# EAGLE design entropy_king_dk (EAGLE 6.5.0)

## Sheet 1 of 2
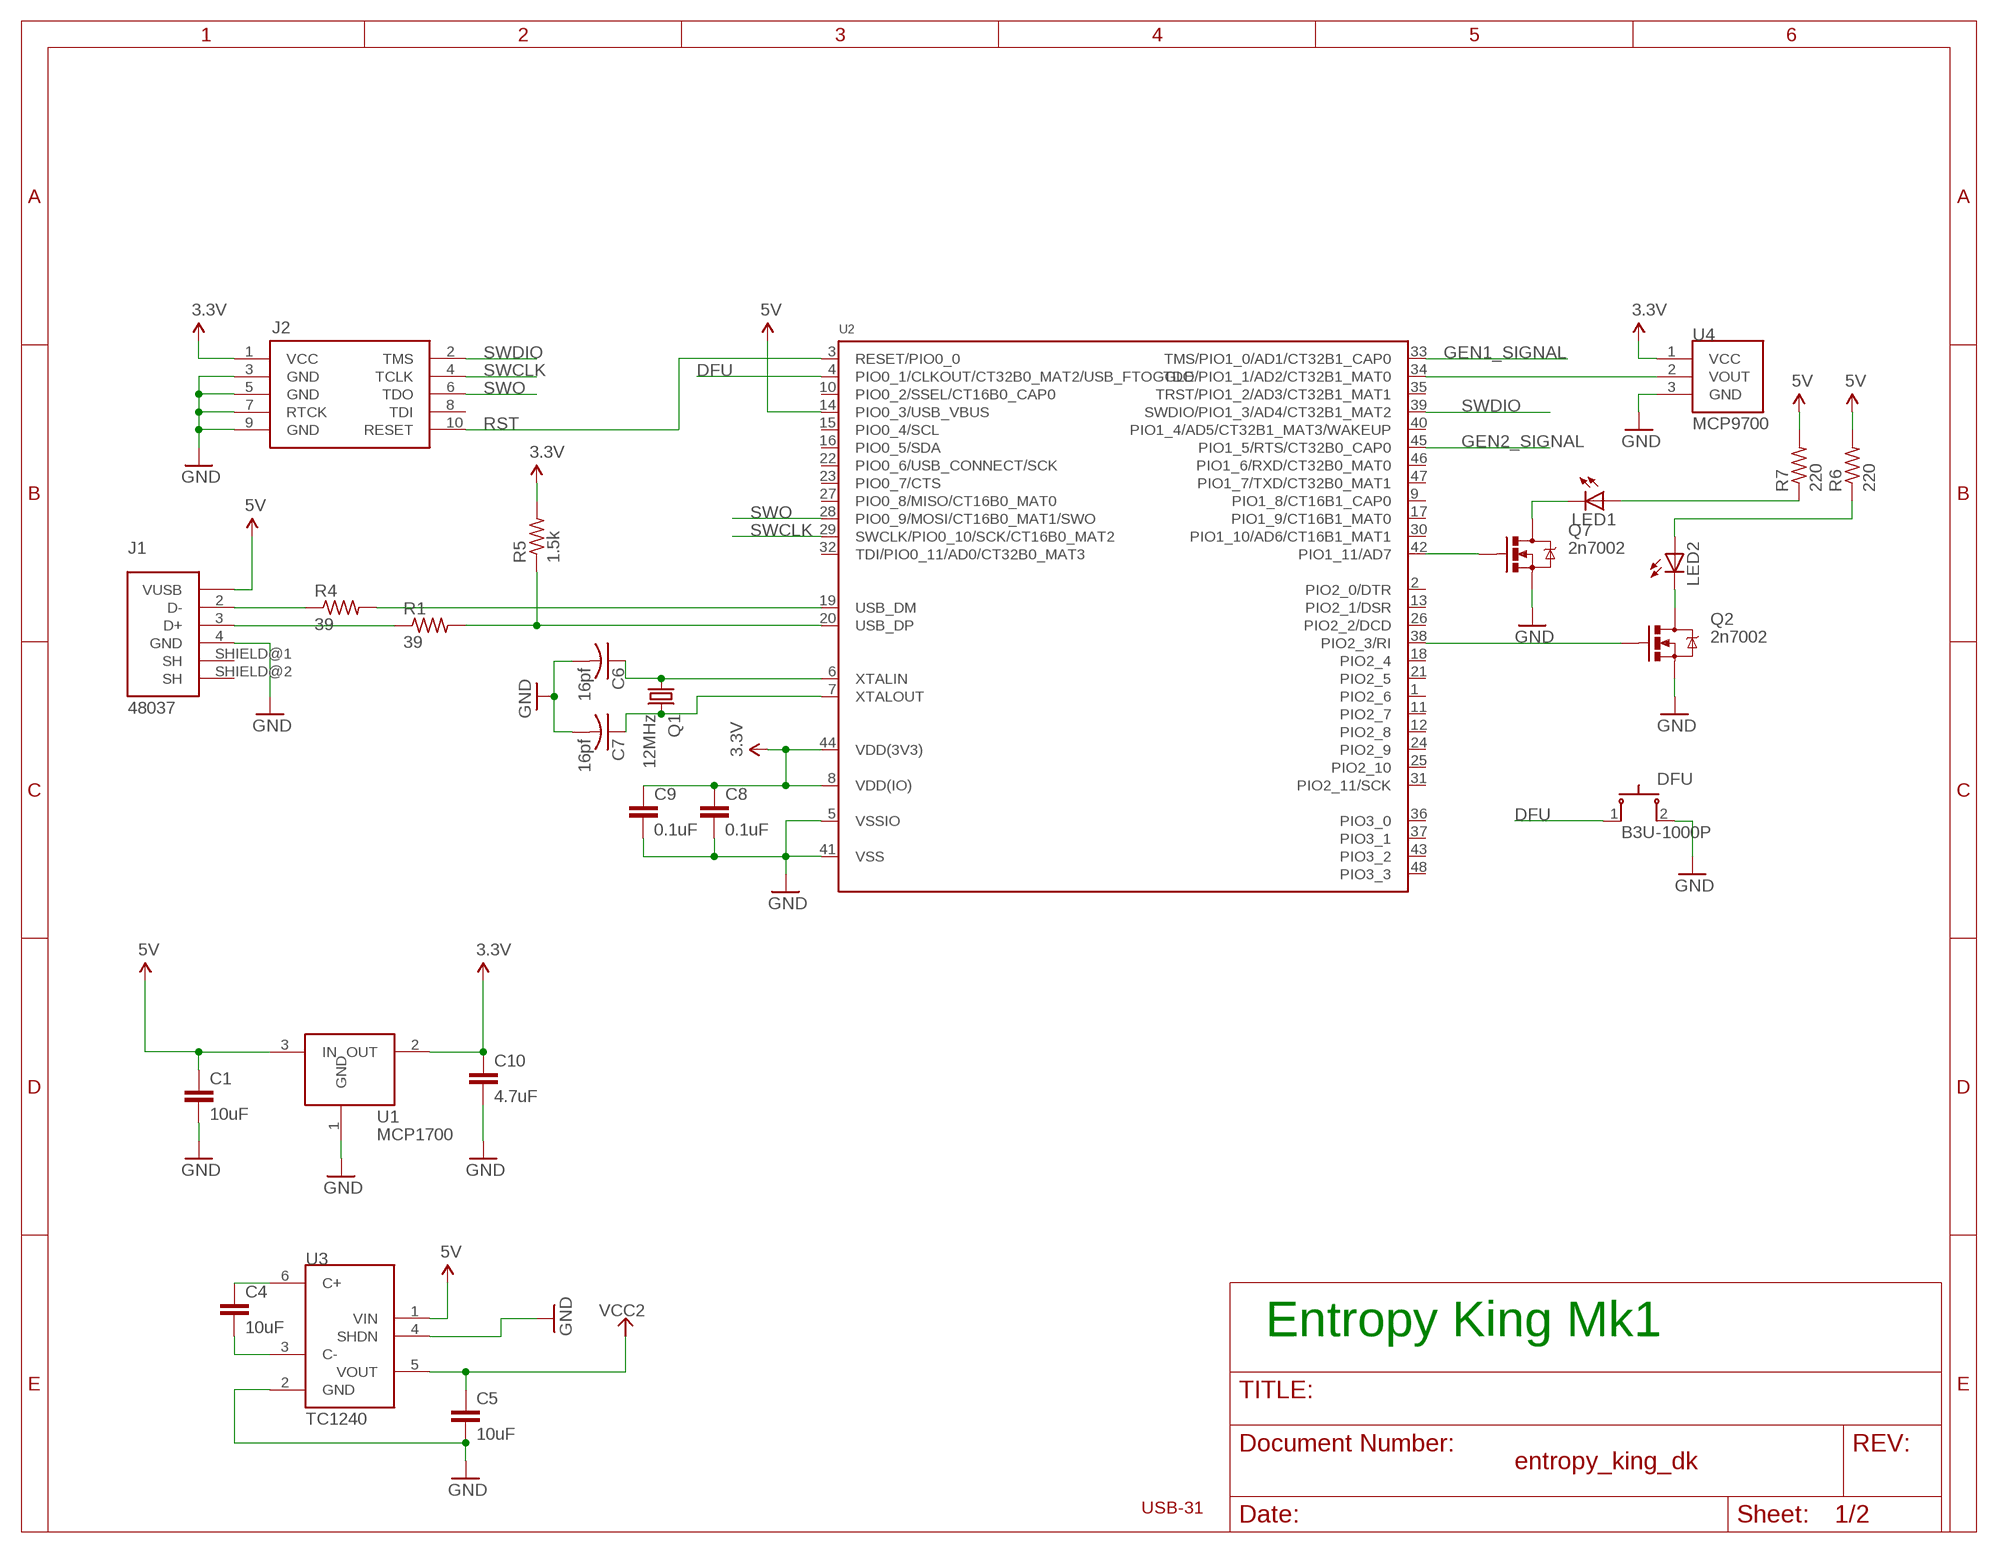
[diagram p0: schematic, sheet 1]

### Parts
C1  10uF  C-EUC0805  [C0805]
C4  10uF  C-EUC0805  [C0805]
C5  10uF  C-EUC0805  [C0805]
C6  16pf  C-USC0603  [C0603]
C7  16pf  C-USC0603  [C0603]
C8  0.1uF  C-EUC0603  [C0603]
C9  0.1uF  C-EUC0603  [C0603]
C10  4.7uF  C-EUC0603  [C0603]
CASE1  USB-31  [USB-31]
DFU  B3U-1000P  [B3U-1000P]
J1  48037  [48037]
J2  ARM_MINI_10PIN_JTAG  [2X05_SMD]
LED1  LED1206  [LED-1206]
LED2  LED1206  [LED-1206]
Q1  12MHz  CRYSTAL25X3.2  [CRYSTAL-SMD-5X3.2]
Q2  2n7002  MOSFET-NCHANNELSMD  [SOT23-3]
Q7  2n7002  MOSFET-NCHANNELSMD  [SOT23-3]
R1  39  R-US_R0603  [R0603]
R4  39  R-US_R0603  [R0603]
R5  1.5k  R-US_R0603  [R0603]
R6  220  R-US_R0603  [R0603]
R7  220  R-US_R0603  [R0603]
U1  MCP1700  [SOT23]
U2  LPC1343_QFP  [LQFP48]
U3  TC1240  [SOT23-6L]
U4  MCP9700  [SOT23]

### Nets
3.3V: C8.1 C9.1 C10.1 J2.1(VCC) R5.2 U1.2(OUT) U2.8(VDD(IO)) U2.44(VDD(3V3)) U4.1(VCC) ; also sheet 2
5V: C1.1 J1.1(VUSB) R6.2 R7.2 U1.3(IN) U2.14(PIO0_3/USB_VBUS) U3.1(VIN)
DFU: DFU.1 U2.4(PIO0_1/CLKOUT/CT32B0_MAT2/USB_FTOGGLE)
GEN1_SIGNAL: U2.33(TMS/PIO1_0/AD1/CT32B1_CAP0) ; also sheet 2
GEN2_SIGNAL: U2.45(PIO1_5/RTS/CT32B0_CAP0) ; also sheet 2
GND: C1.2 C5.2 C6.2 C7.2 C8.2 C9.2 C10.2 DFU.2 J1.4(GND) J2.3(GND) J2.5(GND) J2.7(RTCK) J2.9(GND) Q2.2(S) Q7.2(S) U1.1(GND) U2.5(VSSIO) U2.41(VSS) U3.2(GND) U3.4(SHDN) U4.3(GND) ; also sheet 2
N$2: J1.2(D-) R4.1
N$4: C4.1 U3.6(C+)
N$5: C4.2 U3.3(C-)
N$6: J1.3(D+) R1.1
N$11: Q7.1(G) U2.42(PIO1_11/AD7)
N$12: R4.2 U2.19(USB_DM)
N$14: R1.2 R5.1 U2.20(USB_DP)
N$15: Q2.1(G) U2.38(PIO2_3/RI)
N$16: LED2.C Q2.3(D)
N$17: LED1.C Q7.3(D)
N$18: LED2.A R6.1
N$19: LED1.A R7.1
N$20: U2.34(TDO/PIO1_1/AD2/CT32B1_MAT0) U4.2(VOUT)
RST: J2.10(RESET) U2.3(RESET/PIO0_0)
SWCLK: J2.4(TCLK) U2.29(SWCLK/PIO0_10/SCK/CT16B0_MAT2)
SWDIO: J2.2(TMS) U2.39(SWDIO/PIO1_3/AD4/CT32B1_MAT2)
SWO: J2.6(TDO) U2.28(PIO0_9/MOSI/CT16B0_MAT1/SWO)
VCC2: C5.1 U3.5(VOUT) ; also sheet 2
XIN: C6.1 Q1.1 U2.6(XTALIN)
XOUT: C7.1 Q1.3 U2.7(XTALOUT)
Unconnected: J1.SHIELD@1(SH) J1.SHIELD@2(SH) J2.8(TDI) U2.1(PIO2_6) U2.2(PIO2_0/DTR) U2.9(PIO1_8/CT16B1_CAP0) U2.10(PIO0_2/SSEL/CT16B0_CAP0) U2.11(PIO2_7) U2.12(PIO2_8) U2.13(PIO2_1/DSR) U2.15(PIO0_4/SCL) U2.16(PIO0_5/SDA) U2.17(PIO1_9/CT16B1_MAT0) U2.18(PIO2_4) U2.21(PIO2_5) U2.22(PIO0_6/USB_CONNECT/SCK) U2.23(PIO0_7/CTS) U2.24(PIO2_9) U2.25(PIO2_10) U2.26(PIO2_2/DCD) U2.27(PIO0_8/MISO/CT16B0_MAT0) U2.30(PIO1_10/AD6/CT16B1_MAT1) U2.31(PIO2_11/SCK) U2.32(TDI/PIO0_11/AD0/CT32B0_MAT3) U2.35(TRST/PIO1_2/AD3/CT32B1_MAT1) U2.36(PIO3_0) U2.37(PIO3_1) U2.40(PIO1_4/AD5/CT32B1_MAT3/WAKEUP) U2.43(PIO3_2) U2.46(PIO1_6/RXD/CT32B0_MAT0) U2.47(PIO1_7/TXD/CT32B0_MAT1) U2.48(PIO3_3)

### Notes on the sheet
- Entropy King Mk1

## Sheet 2 of 2
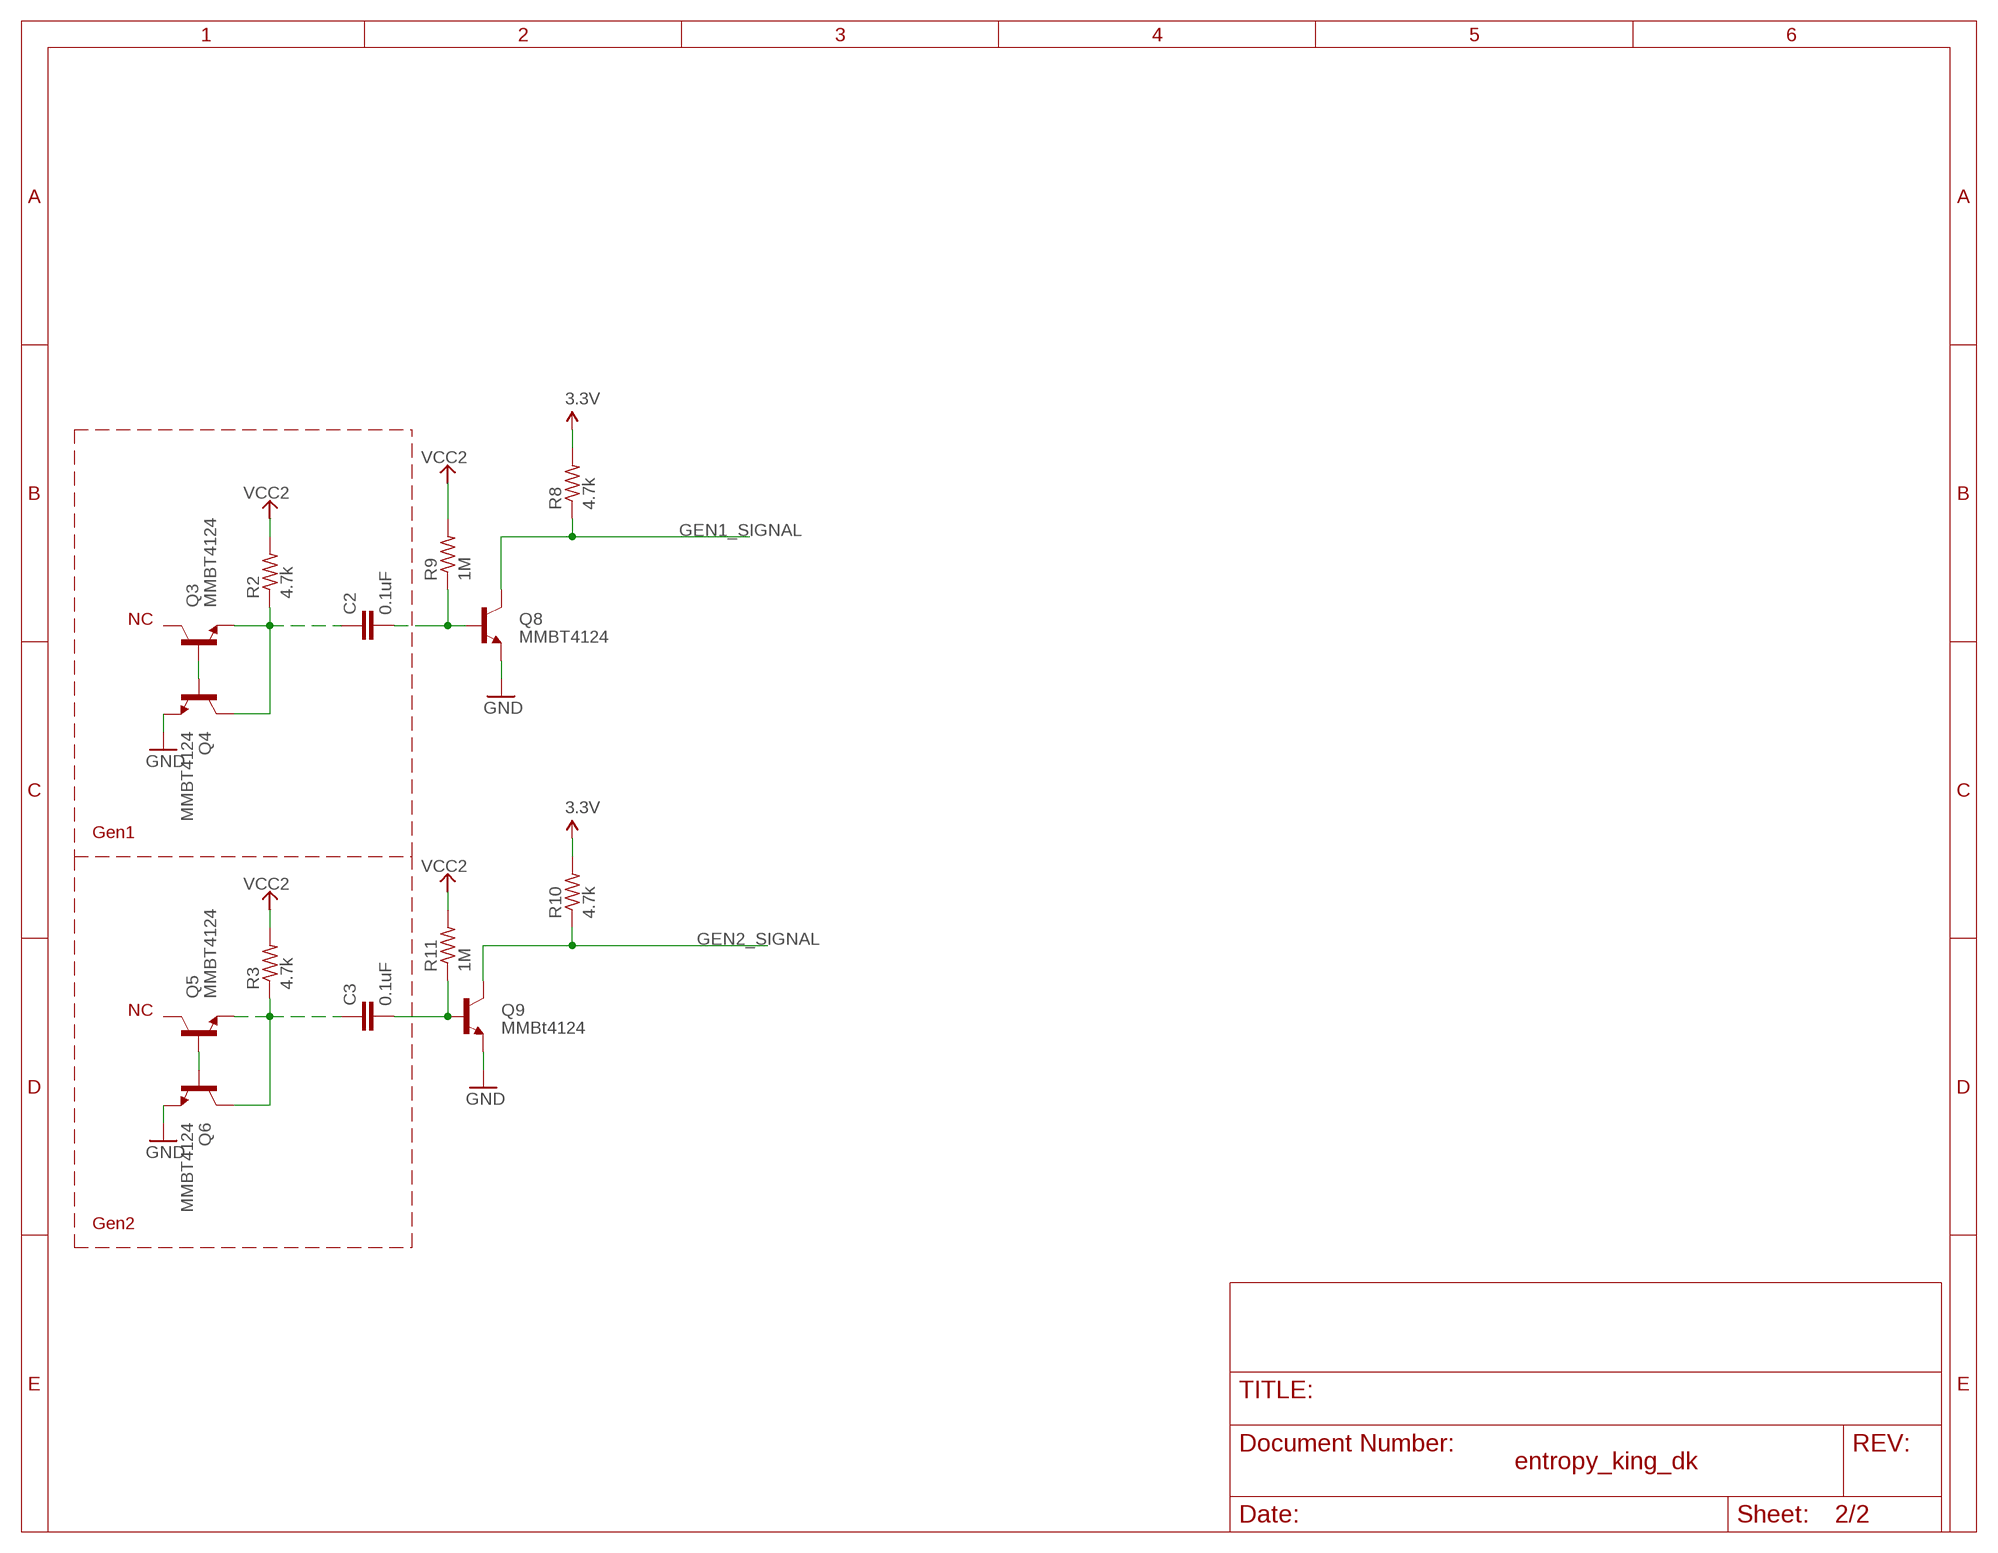
[diagram p1: schematic, sheet 2]

### Parts
C2  0.1uF  C-EUC0603  [C0603]
C3  0.1uF  C-EUC0603  [C0603]
Q3  MMBT4124  TRANSISTOR_NPNSOT23-3  [SOT23-3]
Q4  MMBT4124  TRANSISTOR_NPNSOT23-3  [SOT23-3]
Q5  MMBT4124  TRANSISTOR_NPNSOT23-3  [SOT23-3]
Q6  MMBT4124  TRANSISTOR_NPNSOT23-3  [SOT23-3]
Q8  MMBT4124  TRANSISTOR_NPNSOT23-3  [SOT23-3]
Q9  MMBt4124  TRANSISTOR_NPNSOT23-3  [SOT23-3]
R2  4.7k  R-US_R0603  [R0603]
R3  4.7k  R-US_R0603  [R0603]
R8  4.7k  R-US_R0603  [R0603]
R9  1M  R-US_R0603  [R0603]
R10  4.7k  R-US_R0603  [R0603]
R11  1M  R-US_R0603  [R0603]

### Nets
3.3V: R8.2 R10.2 ; also sheet 1
GEN1_SIGNAL: Q8.3(C) R8.1 ; also sheet 1
GEN2_SIGNAL: Q9.3(C) R10.1 ; also sheet 1
GND: Q4.2(E) Q6.2(E) Q8.2(E) Q9.2(E) ; also sheet 1
N$1: C2.2 Q8.1(B) R9.1
N$3: C3.2 Q9.1(B) R11.1
N$7: C2.1 Q3.2(E) Q4.3(C) R2.1
N$8: Q3.1(B) Q4.1(B)
N$9: Q5.1(B) Q6.1(B)
N$10: C3.1 Q5.2(E) Q6.3(C) R3.1
VCC2: R2.2 R3.2 R9.2 R11.2 ; also sheet 1
Unconnected: Q3.3(C) Q5.3(C)

### Notes on the sheet
- NC
- Gen1
- NC
- Gen2

## Library data of the parts
C1-C5 C8-C10 = rcl:C-EU: CAPACITOR, European symbol
C6 C7 = rcl:C-US: CAPACITOR, American symbol
CASE1 = polycase:USB-31
DFU = switch:B3U-1000P: Ultra Small Tactile Switch
J1 = con-molex:48037: Molex 48037-1000 Surface mount connector with milling layer for tabs.
J2 = con-headers:ARM_MINI_10PIN_JTAG: New style 0.05inch header mini ARM JTAG
LED1 LED2 = SparkFun:LED: LEDs Standard schematic elements and footprints for 5mm, 3mm, 1206, and 0603 sized LEDs. 5mm - Spark Fun Electronics SKU : COM-00529 (and others)
Q1 = xtal:CRYSTAL2: Crystals
Q2 Q7 = SparkFun:MOSFET-NCHANNEL
Q3-Q6 Q8 Q9 = StackFoundry:TRANSISTOR_NPN: Transistor NPN BJT configuration in SOT23 package. MMBT2222 is the common NPN we use. Double check BCE configuration again layout.
R1-R11 = rcl:R-US_: RESISTOR, American symbol
U1 = microchip:MCP1700
U2 = microbuilder:LPC1343_QFP: LPC1343 72 MHz 32-bit ARM Cortex-M3 microcontroller. 32 kB Flash, 8 kB SRAM, USB Device Mouser: 771-LPC1343FBD48151 Digikey: 568-4945-ND
U3 = microchip:TC1240: TC1240/TC1240A Microchip capacitor switcher voltage doubler. Use TC1240A for 5V input systems. 4.7-10-47uF Ceramic capacitors recommended
U4 = microchip:MCP9700: MCP9700 series temperature sensors -40-125C

## Board
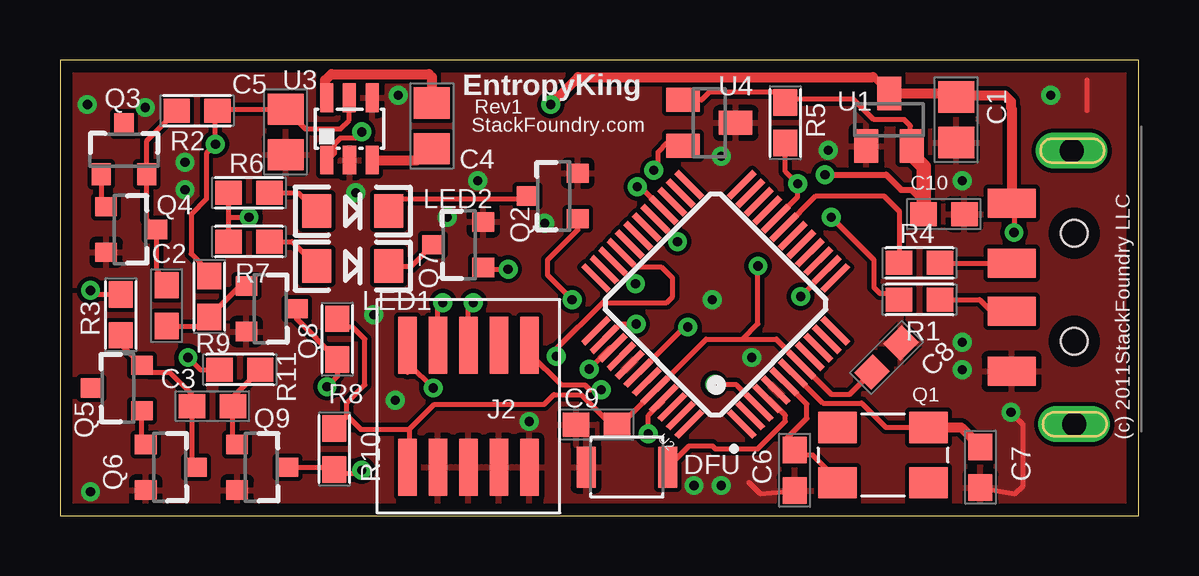
[diagram p2: board, top side]
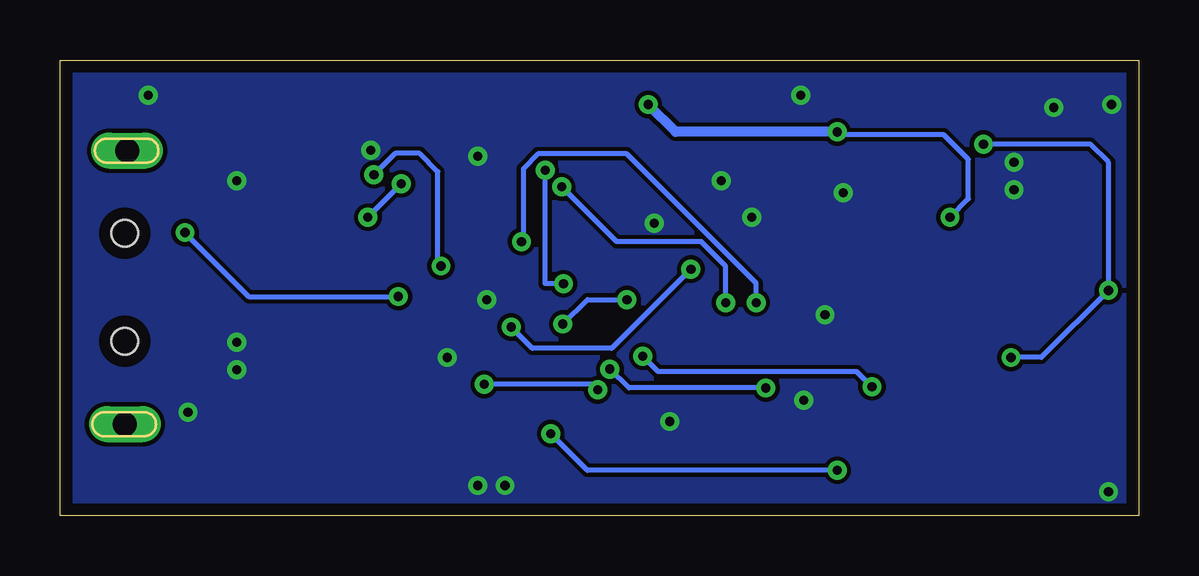
[diagram p3: board, bottom side, seen from below]

Size 44.96 x 19 mm. Coordinates in mm from the lower left corner, seen from the top.
Outline: 0,0 44.96,0 44.96,19 0,19 0,0
Copper layers (1*16): Top 0.035mm / dielectric 1.5mm / Bottom 0.035mm
Design rules "default *": minimum track width 8mil, minimum drill 15mil, track to track 7mil, track to pad 7mil, pad to pad 7mil, via to via 7mil, smd to smd 5mil, copper to edge 20mil, drill to drill 8mil, minimum pad ring 8mil, minimum via ring 8mil, stop-mask expansion 4mil, vias tented up to drill 15mil, thermal gap 10mil

### Footprints (pad centres in the part's own frame; a part is rotated, then mirrored left to right if it is on the bottom)
C0805 = smd 1.3 x 1.5: 1 -0.95,0; 2 0.95,0
C0603 = smd 1.1 x 1: 1 -0.85,0; 2 0.85,0
B3U-1000P = smd 0.8 x 1.7: 1 -1.7,0; 2 1.7,0
48037 = smd 1.2 x 2: 1 3.5,2; 2 1,2; 3 -1,2; 4 -3.5,2 | drill 1 long: SHIELD@1 5.7,-0.5; SHIELD@2 -5.7,-0.6 | hole 1.1: -2.25,-0.6; 2.25,-0.6
2X05_SMD = smd 0.762 x 2.388: 1 -5.08,-3.81; 2 -5.08,1.27; 3 -3.81,-3.81; 4 -3.81,1.27; 5 -2.54,-3.81; 6 -2.54,1.27; 7 -1.27,-3.81; 8 -1.27,1.27; 9 0,-3.81; 10 0,1.27
LED-1206 = smd 1.2 x 1.4: A -1.5,0; C 1.5,0
CRYSTAL-SMD-5X3.2 = smd 1.6 x 1.3: 1 -1.9,-1.15; 2 1.9,-1.15; 3 1.9,1.15; 4 -1.9,1.15
SOT23-3 = smd 0.8 x 0.9: 1 -0.95,-1; 2 0.95,-1; 3 0,1.1
R0603 = smd 1.1 x 1: 1 -0.85,0; 2 0.85,0
SOT23 = smd 1 x 1.4: 1 -0.95,-1.1; 2 0.95,-1.1; 3 0,1.1
LQFP48 = smd 1.5 x 0.25: 1 -4.3,2.75; 2 -4.3,2.25; 3 -4.3,1.75; 4 -4.3,1.25; 5 -4.3,0.75; 6 -4.3,0.25; 7 -4.3,-0.25; 8 -4.3,-0.75; 9 -4.3,-1.25; 10 -4.3,-1.75; 11 -4.3,-2.25; 12 -4.3,-2.75; 25 4.3,-2.75; 26 4.3,-2.25; 27 4.3,-1.75; 28 4.3,-1.25; 29 4.3,-0.75; 30 4.3,-0.25; 31 4.3,0.25; 32 4.3,0.75; 33 4.3,1.25; 34 4.3,1.75; 35 4.3,2.25; 36 4.3,2.75 | smd 0.25 x 1.5: 13 -2.75,-4.3; 14 -2.25,-4.3; 15 -1.75,-4.3; 16 -1.25,-4.3; 17 -0.75,-4.3; 18 -0.25,-4.3; 19 0.25,-4.3; 20 0.75,-4.3; 21 1.25,-4.3; 22 1.75,-4.3; 23 2.25,-4.3; 24 2.75,-4.3; 37 2.75,4.3; 38 2.25,4.3; 39 1.75,4.3; 40 1.25,4.3; 41 0.75,4.3; 42 0.25,4.3; 43 -0.25,4.3; 44 -0.75,4.3; 45 -1.25,4.3; 46 -1.75,4.3; 47 -2.25,4.3; 48 -2.75,4.3
SOT23-6L = smd 0.55 x 1.2: 1 -0.95,-1.3; 2 0,-1.3; 3 0.95,-1.3; 4 0.95,1.3; 5 -0.015,1.3; 6 -0.95,1.3

### Placement (x,y rotation side)
C1  37.34,16.51 270 top
C2  4.45,8.76 270 top
C3  6.35,4.57 0 top
C4  15.49,16.26 270 top
C5  9.4,16 270 top
C6  30.61,1.91 270 top
C7  38.35,2.03 270 top
C8  34.44,6.6 45 top
C9  22.35,3.81 180 top
C10  36.83,12.57 0 top
CASE1  44.96,19.05 180 top
DFU  23.62,2.03 180 top
J1  41.66,9.53 90 top
J2  19.56,5.84 0 top
LED1  12.19,10.41 0 top
LED2  12.19,12.7 0 top
Q1  34.29,2.54 0 top
Q2  20.57,13.34 90 top
Q3  2.67,15.24 0 top
Q4  2.92,11.94 270 top
Q5  2.41,5.33 90 top
Q6  4.57,2.03 270 top
Q7  16.64,11.3 90 top
Q8  8.76,8.64 270 top
Q9  8.38,2.03 270 top
R1  35.81,9.02 180 top
R2  5.71,16.89 0 top
R3  2.54,8.38 90 top
R4  35.81,10.54 180 top
R5  30.23,16.38 90 top
R6  7.87,13.46 180 top
R7  7.87,11.43 180 top
R8  11.56,7.37 90 top
R9  6.22,9.14 90 top
R10  11.43,2.79 90 top
R11  7.49,6.1 180 top
U1  34.54,16.51 0 top
U2  27.31,8.82 135 top
U3  12.06,16.13 0 top
U4  27.05,16.38 270 top

### Tracks (layer width: path | path; a pad name or v marks a point on that pad's centre or on a via)
3.3V  (via drill 0.38)
  Top 0.203: 30.91,6.3 U2.8 | 30.91,6.3 32.13,5.08 32.91,5.08 C8.1 | 30.91,6.3 29.84,7.37 28.45,7.37 | 28.45,7.37 26.93,7.37 U2.44 23.37,3.81 C9.1 23.11,3.86 22.91,3.86 21.72,5.05 20.57,5.05 20.17,4.65 15.6,4.65 14.55,3.61 | 35.49,15.05 U1.2 35.43,15.47 35.43,16.26 35.18,16.51 33.91,16.51 33.06,17.36 30.35,17.36 R5.2 29.81,17.65 27.05,17.65 26.73,17.33 U4.1 | v29.08,10.41 29.08,8 28.45,7.37 | J2.1 14.55,2.11 14.55,3.61 | 14.55,3.61 12.52,3.61 11.94,4.19 | 11.94,4.19 11.94,4.7 12.7,5.46 12.7,7.37 12.19,7.87 11.9,7.87 R8.2 | 11.94,4.19 11.94,4.15 R10.2
  Top 0.254: v31.88,14.22 34.42,14.22 35.05,13.59 35.47,13.59 35.98,13.08
  Top 0.61: 35.49,15.05 35.98,14.56 35.98,13.08 C10.1
  Bottom 0.203: v31.88,14.22 30.99,15.11 29.97,15.11 29.21,14.35 29.21,10.54 v29.08,10.41
5V  (via drill 0.38)
  Top 0.203: U2.14 31.95,10.23 v30.86,9.14 | v39.75,11.81 39.75,12.93 J1.1 | R7.2 7.02,12.45 | 7.02,12.45 R6.2 | 33.87,18.29 U1.3 | v12.57,16 12.32,15.75 11.68,15.75 11.43,15.49 11.43,15.11 11.18,14.86 U3.1 | 7.02,12.45 v7.87,12.45
  Top 0.406: J1.1 39.66,16.99 39.62,17.02 39.62,17.27 39.37,17.53 38.17,17.53 C1.1 37.95,17.61 U1.3 | v20.45,17.14 21.59,18.29 33.87,18.29
  Bottom 0.203: v12.57,16 12.57,15.88 8.13,15.88 7.11,14.86 7.11,13.21 v7.87,12.45 | v30.86,9.14 37.08,9.14 v39.75,11.81
  Bottom 0.406: 20.45,17.02 v20.45,17.14 19.3,16 v12.57,16
DFU
  Top 0.203: DFU.1 26.21,2.92 27.18,2.92 27.3,2.79 29.08,2.79 30.23,3.94 30.23,4.19 29.53,4.89 U2.4 29.47,4.95
GEN1_SIGNAL  (via drill 0.38)
  Top 0.203: v20.68,6.66 20.68,6.96 22.61,8.89 25.27,8.89 25.53,9.14 25.53,9.91 25.07,10.36 24,10.36 U2.33 | Q8.3 9.86,8.21 R8.1 11.56,5.82 v11.12,5.38
  Bottom 0.203: v20.68,6.66 20.04,6.02 11.76,6.02 v11.12,5.38
GEN2_SIGNAL  (via drill 0.38)
  Top 0.203: Q9.3 11.34,2.03 R10.1 11.43,1.78 12.45,1.78 v12.57,1.91 | v24.51,3.43 24.51,4.19 25.15,4.83 U2.45
  Bottom 0.203: v24.51,3.43 22.99,1.91 v12.57,1.91
GND  (via drill 0.38)
  Top 0.203: C7.2 39.79,0.93 40.13,1.27 40.13,3.81 v39.62,4.32 | C6.2 29.17,0.93 28.7,1.4 | 42.8,16.89 42.8,18.16
  other vias: 37.59,6.1 27.56,14.99 32,15.24 27.56,1.27 26.42,1.27 19.56,3.94 13.97,4.83 13.08,8.38 27.18,9.02 28.83,6.6 1.27,1.02 5.21,14.73 5.21,13.59 12.32,13.46 16.13,12.45 17.4,13.97 20.19,12.19 14.1,17.53 37.59,13.97 37.59,7.24 41.27,17.53 3.56,17.02 1.14,17.14
  pour Top: 0.25,18.8 0.25,0.25 44.7,0.25 44.7,18.8
  pour Bottom: 0.25,18.8 0.25,0.51 44.7,0.51 44.7,18.54 0.76,18.54 0.76,18.8
N$1
  Top 0.203: C2.2 5.84,7.91 R9.1 7.51,9.59 Q8.1
N$2
  Top 0.203: J1.2 36.68,10.53 R4.1
N$3
  Top 0.203: Q9.1 7.2,3.16 C3.2 7.2,4.95 R11.1
N$4
  Top 0.406: C4.1 15.49,18.29 15.37,18.41 11.3,18.41 11.05,18.16 11.05,17.5 U3.6
N$5
  Top 0.203: C4.2 15.4,15.21
  Top 0.406: U3.3 14.89,14.83 C4.2
N$6
  Top 0.203: J1.3 38.81,8.53 38.31,9.02 R1.1
N$7
  Top 0.203: C2.1 4.02,10.29 Q4.3 3.62,12.34 Q3.2 3.62,15.64 R2.1
N$8
  Top 0.203: Q3.1 1.72,13.09 Q4.1
N$9
  Top 0.203: Q5.1 3.41,3.14 Q6.1
N$10
  Top 0.203: Q6.3 5.5,2.2 C3.1 5.5,5.04 4.57,5.97 3.73,5.97 Q5.2 2.54,7.16 R3.1
N$11  (via drill 0.38)
  Top 0.203: v18.67,10.29 17.65,10.29 Q7.1 | 24.13,5.97 U2.42 26.02,7.87 v26.16,7.87
  Bottom 0.203: v18.67,10.29 21.97,6.99 25.27,6.99 v26.16,7.87
N$12
  Top 0.203: U2.19 30.19,12.03 31.5,13.34 34.33,13.34 34.96,12.7 R4.2
N$14  (via drill 0.38)
  Top 0.203: v32.13,12.45 33.91,10.67 33.91,9.53 34.16,9.27 34.71,9.27 R1.2 | U2.20 30.73,13.3 v30.73,13.84 30.23,14.35 R5.1
  Bottom 0.203: v30.73,13.84 v32.13,12.45
N$15  (via drill 0.38)
  Top 0.203: Q2.1 21.57,11.92 20.32,10.67 20.32,10.03 v21.34,9.02 | v24,8 23.37,8 22.73,7.37 U2.38
  Bottom 0.203: v24,8 22.99,9.02 v21.34,9.02
N$16
  Top 0.203: LED2.C 14.2,13.21 19.35,13.21 Q2.3
N$17
  Top 0.203: LED1.C 14.65,10.41 Q7.3
N$18
  Top 0.203: R6.1 9.93,13.46 LED2.A
N$19
  Top 0.203: R7.1 9.68,11.43 LED1.A
N$20  (via drill 0.38)
  Top 0.203: v24.74,14.4 24.92,14.58 24.92,15.16 25.3,15.54 U4.2 | v23.98,9.68 U2.34
  Bottom 0.203: v24.74,14.4 24.74,9.68 v23.98,9.68
RST  (via drill 0.38)
  Top 0.203: v22.55,5.26 22.07,5.26 21.87,5.46 20.88,5.46 19.56,6.78 J2.10 | U2.3 28.22,5.44 28.17,5.49 v27.28,5.49
  Bottom 0.203: v22.55,5.26 22.78,5.49 v27.28,5.49
SWCLK  (via drill 0.38)
  Top 0.203: v25.73,11.43 25.73,11.46 24.82,12.37 U2.29 | v15.95,8.89 15.75,8.69 J2.4
  Bottom 0.203: v15.95,8.89 15.95,9.7 21.34,15.09 25.04,15.09 25.65,14.48 25.65,11.51 v25.73,11.43
SWDIO  (via drill 0.38)
  Top 0.203: 14.48,5.97 J2.2 14.55,6.33 v15.54,5.33 | v22.05,6.12 22.94,7.01 23.01,7.01 U2.39
  Bottom 0.203: v22.05,6.12 21.26,5.33 v15.54,5.33
SWO  (via drill 0.38)
  Top 0.203: v17.22,8.89 17.02,8.69 J2.6 | 25.15,12.75 U2.28 24.18,13.72 v24.05,13.72
  Bottom 0.203: v24.05,13.72 21.77,11.43 18.24,11.43 17.22,10.41 v17.22,8.89
VCC2  (via drill 0.38)
  Top 0.203: R3.2 1.44,9.23 v1.27,9.4 | U3.5 12.05,16.5 11.68,16.13 10.22,16.13 C5.1 6.63,16.95 R2.2 6.48,16.8 v6.48,15.49 6.1,15.11 6.1,13.21 5.46,12.57 5.46,10.92 6.22,10.16 R9.2 | R11.2 5.84,6.1 v5.33,6.6
  Bottom 0.203: v6.48,15.49 2.03,15.49 1.27,14.73 v1.27,9.4 4.06,6.6 v5.33,6.6
XIN
  Top 0.203: U2.6 31.11,4.66 31.11,4.06 30.23,3.17 C6.1 30.7,2.54 | 30.44,2.54 30.61,2.54 30.7,2.54 | 30.7,2.54 30.86,2.54 31.37,2.54 32.39,1.52 Q1.1
XOUT
  Top 0.203: Q1.3 34.41,3.69 33.4,4.7 31.78,4.7 U2.7
  Top 0.406: Q1.3 37.55,3.69 C7.1

### Text on the board
tNames: EntropyKing | Rev1 | StackFoundry.com | (c) 2011StackFoundry LLC